# Altium project Power_Part_V1.0.PrjPcb
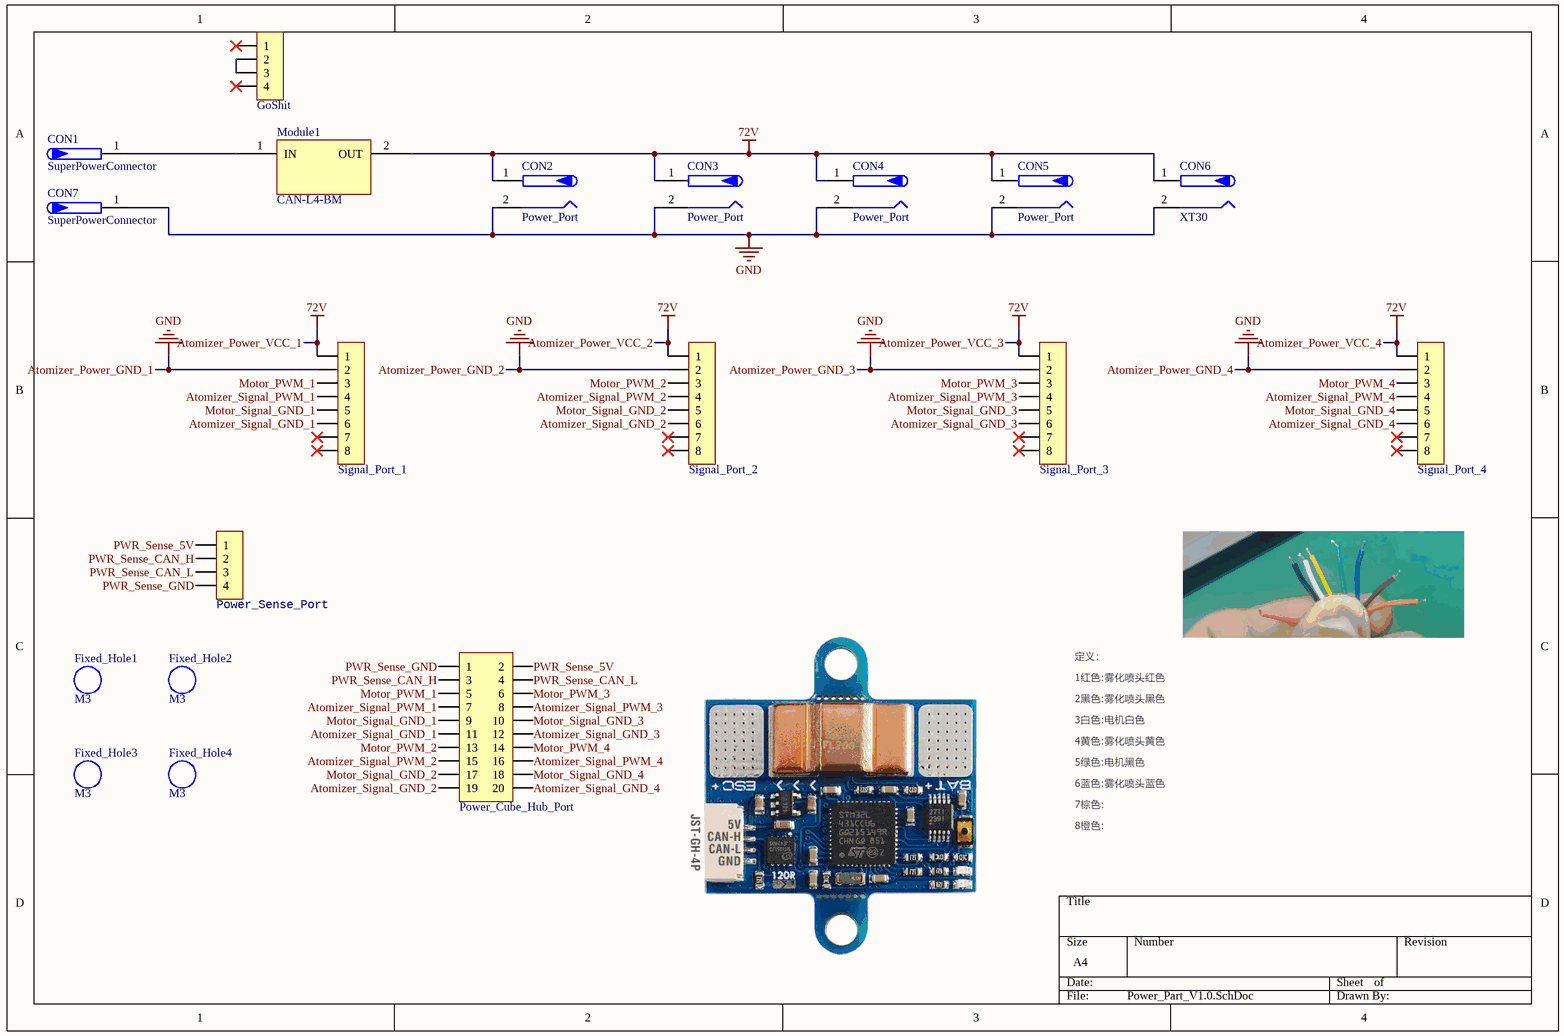
[diagram p0: Power_Part_V1.0.SchDoc]
1 sheet, 19 parts. Net scope: global (net labels, ports and power ports of the same name join across sheets).
Board file: Power_Part_V1.0.PcbDoc

## Sheet Power_Part_V1.0.SchDoc
size A4; SheetNumber: 1; SheetTotal: 1

### Parts
CON1  SuperPowerConnector  [SuperPowerConnector]
CON2  Power_Port  [PAD1]
CON3  Power_Port  [PAD1]
CON4  Power_Port  [PAD1]
CON5  Power_Port  [PAD1]
CON6  XT30  [XT30U-F]
CON7  SuperPowerConnector  [SuperPowerConnector]
Fixed_Hole1  M3  [M3 140X350]
Fixed_Hole2  M3  [M3 140X350]
Fixed_Hole3  M3  [M3 140X350]
Fixed_Hole4  M3  [M3 140X350]
GoShit  HDR-1X4  [KF128-3.81-4P]  (value not drawn)
Module1  CAN-L4-BM  [CAN-L4-BM]
Power_Cube_Hub_Port  Header 2X10  [IDC2.54-LI-2x10P]  (value not drawn)
Power_Sense_Port  HDR-1X4  [GH1.25-WS-4P]  (value not drawn)
Signal_Port_1  HDR-1X8  [HDR2.54-LI-8P]  (value not drawn)
Signal_Port_2  HDR-1X8  [HDR2.54-LI-8P]  (value not drawn)
Signal_Port_3  HDR-1X8  [HDR2.54-LI-8P]  (value not drawn)
Signal_Port_4  HDR-1X8  [HDR2.54-LI-8P]  (value not drawn)

### Nets
Atomizer_Power_GND_1: CON2.2 CON3.2 CON4.2 CON5.2 CON6.2 CON7.1 Signal_Port_1.2 Signal_Port_2.2 Signal_Port_3.2 Signal_Port_4.2  [also labelled Atomizer_Power_GND_2, Atomizer_Power_GND_3, Atomizer_Power_GND_4, GND]
Atomizer_Power_VCC_1: CON2.1 CON3.1 CON4.1 CON5.1 CON6.1 Module1.2(OUT) Signal_Port_1.1 Signal_Port_2.1 Signal_Port_3.1 Signal_Port_4.1  [also labelled 72V, Atomizer_Power_VCC_2, Atomizer_Power_VCC_3, Atomizer_Power_VCC_4]
Atomizer_Signal_GND_1: Power_Cube_Hub_Port.11 Signal_Port_1.6
Atomizer_Signal_GND_2: Power_Cube_Hub_Port.19 Signal_Port_2.6
Atomizer_Signal_GND_3: Power_Cube_Hub_Port.12 Signal_Port_3.6
Atomizer_Signal_GND_4: Power_Cube_Hub_Port.20 Signal_Port_4.6
Atomizer_Signal_PWM_1: Power_Cube_Hub_Port.7 Signal_Port_1.4
Atomizer_Signal_PWM_2: Power_Cube_Hub_Port.15 Signal_Port_2.4
Atomizer_Signal_PWM_3: Power_Cube_Hub_Port.8 Signal_Port_3.4
Atomizer_Signal_PWM_4: Power_Cube_Hub_Port.16 Signal_Port_4.4
Motor_PWM_1: Power_Cube_Hub_Port.5 Signal_Port_1.3
Motor_PWM_2: Power_Cube_Hub_Port.13 Signal_Port_2.3
Motor_PWM_3: Power_Cube_Hub_Port.6 Signal_Port_3.3
Motor_PWM_4: Power_Cube_Hub_Port.14 Signal_Port_4.3
Motor_Signal_GND_1: Power_Cube_Hub_Port.9 Signal_Port_1.5
Motor_Signal_GND_2: Power_Cube_Hub_Port.17 Signal_Port_2.5
Motor_Signal_GND_3: Power_Cube_Hub_Port.10 Signal_Port_3.5
Motor_Signal_GND_4: Power_Cube_Hub_Port.18 Signal_Port_4.5
PWR_Sense_5V: Power_Cube_Hub_Port.2 Power_Sense_Port.1
PWR_Sense_CAN_H: Power_Cube_Hub_Port.3 Power_Sense_Port.2
PWR_Sense_CAN_L: Power_Cube_Hub_Port.4 Power_Sense_Port.3
PWR_Sense_GND: Power_Cube_Hub_Port.1 Power_Sense_Port.4
NetCON1_1: CON1.1 Module1.1(IN)
NetGoShit_2: GoShit.2 GoShit.3

Not connected (* = marked no-connect by the designer): GoShit 1* 4*; Signal_Port_1 7* 8*; Signal_Port_2 7* 8*; Signal_Port_3 7* 8*; Signal_Port_4 7* 8*

### Library data of the parts
CON2-CON6 = XT电源接口-2Pins: 电源接口; BOM名称: XT航模电源接口
Fixed_Hole1-Fixed_Hole4 = M3: 铜柱孔; BOM名称: 铜柱孔
GoShit Power_Sense_Port = Header 4: 4P接插件; BOM名称: 4P接插件
Power_Cube_Hub_Port = Header 10X2: 10*2P接插件; BOM名称: 10*2P接插件
Signal_Port_1-Signal_Port_4 = Header 8: 8P接插件; BOM名称: 8P接插件